# Altium schematic sheet GPS.SchDoc
size B; DocumentNumber: 2; SheetNumber: 2; SheetTotal: 6
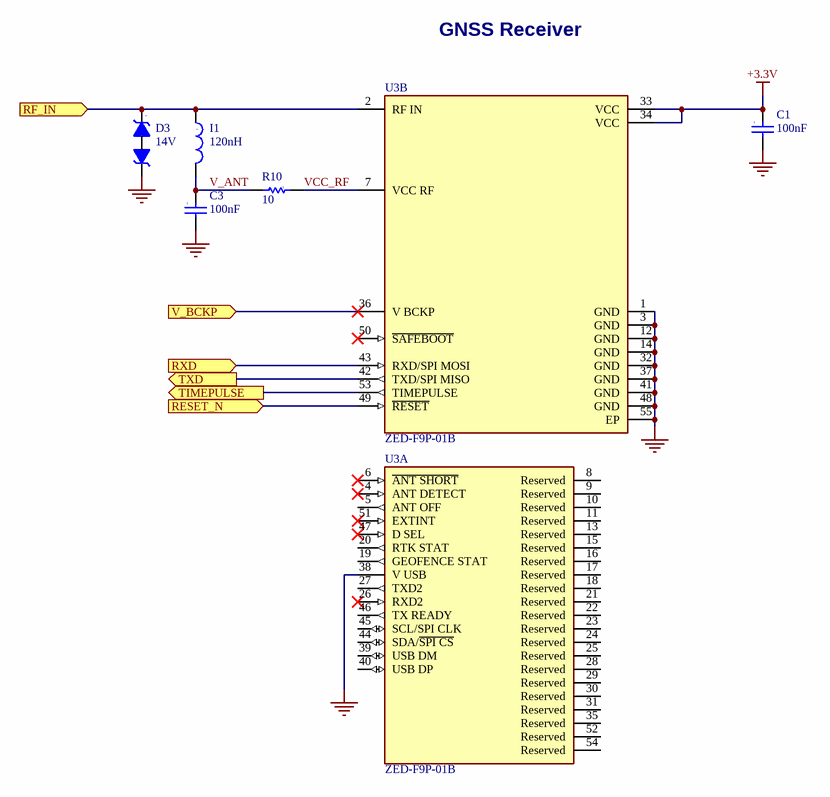
[diagram p0: GPS.SchDoc]

## Parts
C1  value 100nF  [0402]  (hidden comment: Cap)
C3  value 100nF  [0402]  (hidden comment: Cap)
D3  Working Voltage: 14V  [R0402]  (hidden comment: Diode - Bidirectional Zener)
I1  value 120nH  [0402]  (hidden comment: Inductor)
R10  value 10  [R0402]  (hidden comment: Res)
U3  ZED-F9P-01B  [U-Blox_ZED-F9P]  (parts A,B of 2)

## Ports
RESET_N (in), RF_IN (in), RXD (in), TIMEPULSE (out), TXD (out), V_BCKP (in)

## Nets
+3.3V: C1.1 U3.33(VCC) U3.34(VCC)
GND: C1.2 C3.2 D3.2 U3.1(GND) U3.3(GND) U3.12(GND) U3.14(GND) U3.32(GND) U3.37(GND) U3.38(V_USB) U3.41(GND) U3.48(GND) U3.55(EP)
RESET_N: U3.49(~{RESET}) ; port RESET_N
RF_IN: D3.1 I1.1 U3.2(RF_IN) ; port RF_IN
RXD: U3.43(RXD/SPI_MOSI) ; port RXD
TIMEPULSE: U3.53(TIMEPULSE) ; port TIMEPULSE
TXD: U3.42(TXD/SPI_MISO) ; port TXD
V_ANT: C3.1 I1.2 R10.2
V_BCKP: U3.36(V_BCKP) ; port V_BCKP
VCC_RF: R10.1 U3.7(VCC_RF)

Not connected (* = marked no-connect by the designer): U3 4(ANT_DETECT)* 5(ANT_OFF) 6(~{ANT_SHORT})* 8(Reserved) 9(Reserved) 10(Reserved) 11(Reserved) 13(Reserved) 15(Reserved) 16(Reserved) 17(Reserved) 18(Reserved) 19(GEOFENCE_STAT) 20(RTK_STAT) 21(Reserved) 22(Reserved) 23(Reserved) 24(Reserved) 25(Reserved) 26(RXD2)* 27(TXD2) 28(Reserved) 29(Reserved) 30(Reserved) 31(Reserved) 35(Reserved) 39(USB_DM) 40(USB_DP) 44(SDA/~{SPI_CS}) 45(SCL/SPI_CLK) 46(TX_READY) 47(D_SEL)* 50(~{SAFEBOOT})* 51(EXTINT)* 52(Reserved) 54(Reserved)

## Notes on the sheet
- GNSS Receiver
- C O N F I D E N T I A L / P R O P R I E T A R Y
- Date
- Sheet
- Project
- Time
- PCB
- Assy
- of
- Size
- B
- File

## Library data of the parts
C1 C3 = Cap: CAP CER .10UF 50V X7R 10% 0402; Manufacturer: TDK Corporation; Manufacturer Part Number: C1005X7R1H104K; Capacitance: 0.1µF; Published: 8-Jun-2000; LatestRevisionDate: 17-Jul-2002; LatestRevisionNote: Re-released for DXP Platform.; Publisher: Altium Limited; Category: Capacitors; Supplier 1: Digi-Key; Supplier Part Number 1: 445-5932-1-ND; RoHS: RoHS Compliant; Stock 1: 174080; Pricing 1: 1=0.3, 10=0.2, 100=0.08, 250=0.05752, 500=0.041, 1000=0.03 (USD); Voltage - Rated: 50V; Tolerance: ±10%; Temperature Coefficient: X7R; Mounting Type: Surface Mount, MLCC; Operating Temperature: -55°C ~ 125°C; Applications: General Purpose; Ratings: -; Package / Case: 0402 (1005 Metric); Size / Dimension: 0.039" L x 0.020" W (1.00mm x 0.50mm); Height: -; Thickness: 0.022" (0.55mm); Lead Spacing: -; Features: -; Packaging: Cut Tape (CT); Lead Style: -; ComponentLink1URL: http://www.tdk.co.jp/tefe02/e412_c.pdf; ComponentLink1Description: http://www.tdk.co.jp/tefe02/e412_c.pdf
D3 = Diode - Bidirectional Zener: LITTELFUSE - PESD0402-140 - DIODE, ESD PROTECTION, 0402, FULL REEL; Clamping Voltage: 40V; Number of Bidirectional Channels: 1; Power Line Protection: No; Turn-On Delay Time: 1ns; Supplier 1: Digi-Key; Supplier Part Number 1: PESD0402-140CT-ND; Manufacturer: Littelfuse; Manufacturer Part Number: PESD0402-140; RoHS: No; Category: TVS Diodes; Stock 1: 211482; Pricing 1: 1=0.40000, 10=0.32100, 100=0.22900, 500=0.17400, 1000=0.13737, 2000=0.13279, 5000=0.12821 (USD); Mount: Surface Mount; Case/Package: 0402; Number of Pins: 2; Min Operating Temperature: -55°C; Max Operating Temperature: 125°C; Packaging: Tape and Reel; Direction: Bidirectional; Reverse Standoff Voltage: 14V; Resistor Type: Zener; Operating Supply Voltage: 14V; Lead Free: Lead Free; REACH SVHC: Unknown; ComponentLink1URL: https://datasheet.ciiva.com/58684/-58684341.pdf?src-supplier=Digi-Key; ComponentLink1Description: https://datasheet.ciiva.com/58684/-58684341.pdf?src-supplier=Digi-Key
I1 = Inductor: Inductor RF Chip Wirewound 120nH 5% 100MHz 20Q-Factor 110mA 2.66Ohm DCR 0402 Paper T/R; Manufacturer: Murata; Manufacturer Part Number: LQW15ANR12J00D; Core Material: Air,Ferrite; DC Resistance (DCR): 2.66R; Shielding: Unshielded; Self Resonant Frequency: 1GHz; ComponentLink1URL: http://search.murata.co.jp/Ceramy/image/img/PDF/ENG/L0075S0083LQG15HS.pdf; ComponentLink1Description: http://search.murata.co.jp/Ceramy/image/img/PDF/ENG/L0075S0083LQG15HS.pdf; Supplier 1: Digi-Key; Supplier Part Number 1: 490-4091-1-ND; RoHS: Yes; Category: Fixed Inductors; Stock 1: 2053; Pricing 1: 1=0.15000, 10=0.13500, 25=0.12000, 50=0.10200, 100=0.09000, 250=0.08252, 500=0.07500, 1000=0.06300, 2500=0.05400 (USD); Mount: Surface Mount; Case/Package: 0402; Number of Pins: 2; Case Code (Imperial): 0402; Weight: 2.8E-05oz; Case Code (Metric): 1005; Min Operating Temperature: -55°C; Max Operating Temperature: 125°C; Tolerance: 5%; Inductance: 120nH; Max DC Current: 110mA; Packaging: Tape and Reel; Inductance Tolerance: 5%; Package Quantity: 10000; Current Rating: 110mA; Test Frequency: 100MHz; Termination: SMD/SMT; DC Current: 110mA; Length: 1mm; Width: 0.02inch; Height: 0.5mm; Depth: 0.6mm; Radiation Hardening: No; Lead Free: Lead Free; Military Standard: Not; REACH SVHC: No SVHC; ComponentLink2URL: https://datasheet.ciiva.com/11799/0900766b8090d800-11799096.pdf?src-supplier=RSComponents; ComponentLink2Description: https://datasheet.ciiva.com/11799/0900766b8090d800-11799096.pdf?src-supplier=RSComponents; ComponentLink3URL: https://datasheet.ciiva.com/1042/l0075s0080lqw15a-00-1042180.pdf?src-supplier=Digi-Key; ComponentLink3Description: https://datasheet.ciiva.com/1042/l0075s0080lqw15a-00-1042180.pdf?src-supplier=Digi-Key; ComponentLink4URL: https://datasheet.ciiva.com/1042/l0075s0080lqw15a-00-1042181.pdf?src-supplier=Digi-Key; ComponentLink4Description: https://datasheet.ciiva.com/1042/l0075s0080lqw15a-00-1042181.pdf?src-supplier=Digi-Key; ComponentLink5URL: https://datasheet.ciiva.com/1042/l0075s0080lqw15a-00-1042182.pdf?src-supplier=Digi-Key; ComponentLink5Description: https://datasheet.ciiva.com/1042/l0075s0080lqw15a-00-1042182.pdf?src-supplier=Digi-Key; ComponentLink6URL: https://datasheet.ciiva.com/16207/l0075s0080lqw15a-00-16207819.pdf?src-supplier=Future+Electronics; ComponentLink6Description: https://datasheet.ciiva.com/16207/l0075s0080lqw15a-00-16207819.pdf?src-supplier=Future+Electronics; ComponentLink7URL: https://datasheet.ciiva.com/8506/l0075s0080lqw15a-00-8506030.pdf?src-supplier=Avnet; ComponentLink7Description: https://datasheet.ciiva.com/8506/l0075s0080lqw15a-00-8506030.pdf?src-supplier=Avnet
R10 = Res: RES SMD 10 OHM 5% 1/5W 0402; Manufacturer: Rohm Semiconductor; Manufacturer Part Number: ESR01MZPJ100; Power (Watts): 0.2W, 1/5W; Temperature Coefficient: ±200ppm/°C; Supplier 1: Digi-Key; Supplier Part Number 1: RHM1000CT-ND; RoHS: RoHS Compliant; Category: Resistors; Stock 1: 32481; Pricing 1: 1=0.23, 10=0.194, 25=0.1408, 100=0.0757, 250=0.05808, 500=0.04576, 1000=0.03168, 5000=0.0264 (USD); Packaging: Cut Tape (CT); Resistance (Ohms): 10; Tolerance: ±5%; Composition: Thick Film; Features: Pulse Withstanding; Operating Temperature: -55°C ~ 155°C; Package / Case: 0402 (1005 Metric); Supplier Device Package: 0402 (1005 Metric); Size / Dimension: 0.039" L x 0.020" W (1.00mm x 0.50mm); Height: 0.016" (0.40mm); Number of Terminations: 2; ComponentLink1URL: http://rohmfs.rohm.com/en/products/databook/datasheet/passive/resistor/chip_resistor/esr.pdf; ComponentLink1Description: http://rohmfs.rohm.com/en/products/databook/datasheet/passive/resistor/chip_resistor/esr.pdf
U3 = U-Blox_ZED-F9P-01B_Client(IS): ZED-F9P RF Receiver BeiDou, Galileo, GLONASS, GNSS, GPS 1.2276GHz ~ 1.575GHz -167dBm 921.6kbps 54-LGA (22x17); Manufacturer: u-blox; Supplier 1: Digi-Key; RoHS: No; Stock 1: 1667; Pricing 1: 1=199.00000, 10=167.77000, 50=152.65000, 100=138.79050 (USD); Supplier Part Number 1: 672-ZED-F9P-01BCT-ND; Manufacturer Part Number: ZED-F9P-01B